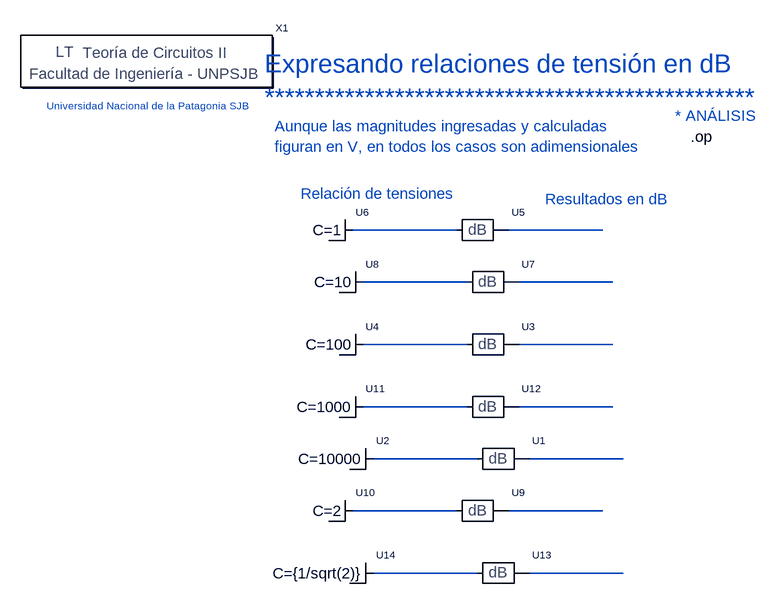
[diagram p0: schematic Expresando relaciones de tensión en dB.asc]
Expresando relaciones de tensión en dB.asc, the LTspice schematic file:
Version 4
SHEET 1 880 680
WIRE 32 -112 -96 -112
WIRE 64 -112 32 -112
WIRE 272 -112 144 -112
WIRE 288 -112 272 -112
WIRE 48 -32 -80 -32
WIRE 80 -32 48 -32
WIRE 288 -32 160 -32
WIRE 304 -32 288 -32
WIRE 48 64 -80 64
WIRE 80 64 48 64
WIRE 288 64 160 64
WIRE 304 64 288 64
WIRE 48 160 -80 160
WIRE 80 160 48 160
WIRE 288 160 160 160
WIRE 304 160 288 160
WIRE 64 240 -64 240
WIRE 96 240 64 240
WIRE 304 240 176 240
WIRE 320 240 304 240
WIRE 32 320 -96 320
WIRE 64 320 32 320
WIRE 272 320 144 320
WIRE 288 320 272 320
WIRE 16 416 -64 416
WIRE 96 416 16 416
WIRE 304 416 176 416
WIRE 320 416 304 416
DATAFLAG 304 240 ""
DATAFLAG 64 240 ""
DATAFLAG 288 64 ""
DATAFLAG 48 64 ""
DATAFLAG 272 -112 ""
DATAFLAG 32 -112 ""
DATAFLAG 288 -32 ""
DATAFLAG 48 -32 ""
DATAFLAG 288 160 ""
DATAFLAG 48 160 ""
DATAFLAG 272 320 ""
DATAFLAG 32 320 ""
DATAFLAG 304 416 ""
DATAFLAG 16 416 ""
SYMBOL dB 128 240 R0
SYMATTR Description Expresión en dB para relación de tensiones dB= 20*Logarítmo de base 10 (V2/V1)
SYMATTR InstName U1
SYMBOL constantei -96 240 R0
SYMATTR Value C=10000
SYMATTR InstName U2
SYMBOL dB 112 64 R0
SYMATTR Description Expresión en dB para relación de tensiones dB= 20*Logarítmo de base 10 (V2/V1)
SYMATTR InstName U3
SYMBOL constantei -112 64 R0
SYMATTR Value C=100
SYMATTR InstName U4
SYMBOL dB 96 -112 R0
SYMATTR Description Expresión en dB para relación de tensiones dB= 20*Logarítmo de base 10 (V2/V1)
SYMATTR InstName U5
SYMBOL constantei -128 -112 R0
SYMATTR Value C=1
SYMATTR InstName U6
SYMBOL dB 112 -32 R0
SYMATTR Description Expresión en dB para relación de tensiones dB= 20*Logarítmo de base 10 (V2/V1)
SYMATTR InstName U7
SYMBOL constantei -112 -32 R0
SYMATTR InstName U8
SYMBOL constantei -112 160 R0
SYMATTR Value C=1000
SYMATTR InstName U11
SYMBOL dB 112 160 R0
SYMATTR Description Expresión en dB para relación de tensiones dB= 20*Logarítmo de base 10 (V2/V1)
SYMATTR InstName U12
SYMBOL dB 96 320 R0
SYMATTR Description Expresión en dB para relación de tensiones dB= 20*Logarítmo de base 10 (V2/V1)
SYMATTR InstName U9
SYMBOL constantei -128 320 R0
SYMATTR Value C=2
SYMATTR InstName U10
SYMBOL dB 128 416 R0
SYMATTR Description Expresión en dB para relación de tensiones dB= 20*Logarítmo de base 10 (V2/V1)
SYMATTR InstName U13
SYMBOL constantei -96 416 R0
SYMATTR Value C={1/sqrt(2)}
SYMATTR InstName U14
SYMBOL Circuitos2\\Letreros\\Teoría\ de\ Circuitos\ II -416 -368 R0
SYMATTR InstName X1
TEXT 424 -256 Left 2 !.op
TEXT -232 -368 Left 4 ;Expresando relaciones de tensión en dB\n*************************************************
TEXT 200 -160 Left 2 ;Resultados en dB
TEXT -176 -168 Left 2 ;Relación de tensiones
TEXT -216 -272 Left 2 ;Aunque las magnitudes ingresadas y calculadas\nfiguran en V, en todos los casos son adimensionales
TEXT 400 -288 Left 2 ;* ANÁLISIS
TEXT -416 -304 Center 1 ;Universidad Nacional de la Patagonia SJB

The netlist it stands for:
* Expresando relaciones de tensión en dB.asc
XU1 N009 N010 decibel  ; pins in out
XU2 N009 constante C=10000  ; pins p
XU3 N005 N006 decibel  ; pins in out
XU4 N005 constante C=100  ; pins p
XU5 N001 N002 decibel  ; pins in out
XU6 N001 constante C=1  ; pins p
XU7 N003 N004 decibel  ; pins in out
XU8 N003 constante C=10  ; pins p
XU11 N007 constante C=1000  ; pins p
XU12 N007 N008 decibel  ; pins in out
XU9 N011 N012 decibel  ; pins in out
XU10 N011 constante C=2  ; pins p
XU13 N013 N014 decibel  ; pins in out
XU14 N013 constante C={1/sqrt(2)}  ; pins p
XX1 Teoría de Circuitos II
.op
* Expresando relaciones de tensión en dB
* *************************************************
* Resultados en dB
* Relación de tensiones
* Aunque las magnitudes ingresadas y calculadas
* figuran en V, en todos los casos son adimensionales
* * ANÁLISIS
* Universidad Nacional de la Patagonia SJB
.lib ..\sym\Circuitos2\FuncionesMatematicas\funmate.lib
.backanno
.end